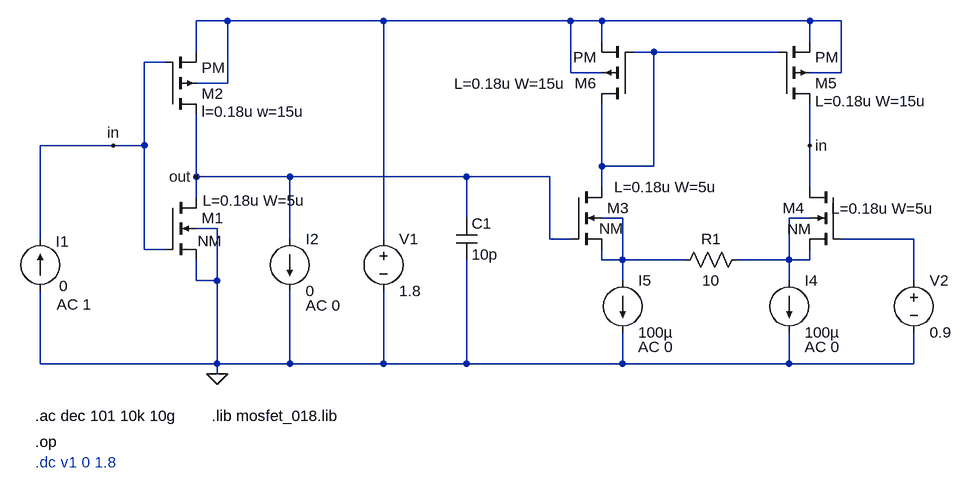
[diagram p0: schematic gyrator.asc]
gyrator.asc, the LTspice schematic file:
Version 4
SHEET 1 2240 2444
WIRE 288 -48 240 -48
WIRE 528 -48 288 -48
WIRE 816 -48 528 -48
WIRE 864 -48 816 -48
WIRE 1184 -48 864 -48
WIRE 1232 -48 1184 -48
WIRE 864 -16 864 -48
WIRE 1184 -16 1184 -48
WIRE 240 0 240 -48
WIRE 944 0 912 0
WIRE 1136 0 944 0
WIRE 192 16 160 16
WIRE 816 32 816 -48
WIRE 864 32 816 32
WIRE 1232 32 1232 -48
WIRE 1232 32 1184 32
WIRE 288 48 288 -48
WIRE 288 48 240 48
WIRE 112 144 0 144
WIRE 160 144 160 16
WIRE 160 144 112 144
WIRE 1184 144 1184 80
WIRE 864 176 864 80
WIRE 944 176 944 0
WIRE 944 176 864 176
WIRE 240 192 240 96
WIRE 384 192 240 192
WIRE 656 192 384 192
WIRE 784 192 656 192
WIRE 864 208 864 176
WIRE 1184 208 1184 144
WIRE 240 224 240 192
WIRE 656 256 656 192
WIRE 896 256 864 256
WIRE 1184 256 1152 256
WIRE 272 272 240 272
WIRE 0 288 0 144
WIRE 384 288 384 192
WIRE 528 288 528 -48
WIRE 784 288 784 192
WIRE 816 288 784 288
WIRE 1344 288 1232 288
WIRE 160 304 160 144
WIRE 192 304 160 304
WIRE 864 320 864 304
WIRE 896 320 896 256
WIRE 896 320 864 320
WIRE 992 320 896 320
WIRE 1152 320 1152 256
WIRE 1152 320 1072 320
WIRE 1184 320 1184 304
WIRE 1184 320 1152 320
WIRE 240 352 240 320
WIRE 272 352 272 272
WIRE 272 352 240 352
WIRE 896 352 896 320
WIRE 1152 352 1152 320
WIRE 1344 352 1344 288
WIRE 0 480 0 368
WIRE 272 480 272 352
WIRE 272 480 0 480
WIRE 384 480 384 368
WIRE 384 480 272 480
WIRE 528 480 528 368
WIRE 528 480 384 480
WIRE 656 480 656 320
WIRE 656 480 528 480
WIRE 896 480 896 432
WIRE 896 480 656 480
WIRE 1152 480 1152 432
WIRE 1152 480 896 480
WIRE 1344 480 1344 432
WIRE 1344 480 1152 480
WIRE 272 496 272 480
FLAG 272 496 0
FLAG 112 144 in
FLAG 240 192 out
FLAG 1184 144 in
SYMBOL nmos4 192 224 R0
WINDOW 3 50 67 Left 2
WINDOW 123 58 5 Left 2
SYMATTR Value NM
SYMATTR Value2 L=0.18u W=5u
SYMATTR InstName M1
SYMBOL voltage 528 272 R0
SYMATTR InstName V1
SYMATTR Value 1.8
SYMBOL pmos4 192 96 M180
WINDOW 123 56 4 Left 2
SYMATTR Value2 l=0.18u w=15u
SYMATTR InstName M2
SYMATTR Value PM
SYMBOL current 0 368 M180
WINDOW 123 25 -21 Left 2
WINDOW 0 24 76 Left 2
WINDOW 3 29 8 Left 2
SYMATTR Value2 AC 1
SYMATTR InstName I1
SYMATTR Value 0
SYMBOL current 384 288 R0
WINDOW 123 24 102 Left 2
SYMATTR Value2 AC 0
SYMATTR InstName I2
SYMATTR Value 0
SYMBOL nmos4 816 208 R0
WINDOW 3 44 64 Left 2
WINDOW 123 67 0 Left 2
SYMATTR Value NM
SYMATTR Value2 L=0.18u W=5u
SYMATTR InstName M3
SYMBOL nmos4 1232 208 M0
WINDOW 3 45 65 Left 2
WINDOW 123 -144 33 Left 2
SYMATTR Value NM
SYMATTR Value2 L=0.18u W=5u
SYMATTR InstName M4
SYMBOL pmos4 1136 80 M180
WINDOW 123 56 4 Left 2
SYMATTR Value2 L=0.18u W=15u
SYMATTR InstName M5
SYMATTR Value PM
SYMBOL pmos4 912 80 R180
WINDOW 123 103 31 Left 2
SYMATTR Value2 L=0.18u W=15u
SYMATTR InstName M6
SYMATTR Value PM
SYMBOL voltage 1344 336 R0
SYMATTR InstName V2
SYMATTR Value 0.9
SYMBOL cap 640 256 R0
SYMATTR InstName C1
SYMATTR Value 10p
SYMBOL current 1152 352 R0
WINDOW 123 24 102 Left 2
SYMATTR Value2 AC 0
SYMATTR InstName I4
SYMATTR Value 100µ
SYMBOL current 896 352 R0
WINDOW 123 24 102 Left 2
SYMATTR Value2 AC 0
SYMATTR InstName I5
SYMATTR Value 100µ
SYMBOL res 1088 304 R90
WINDOW 0 0 56 VBottom 2
WINDOW 3 32 56 VTop 2
SYMATTR InstName R1
SYMATTR Value 10
TEXT -8 632 Left 2 ;.dc v1 0 1.8
TEXT -8 600 Left 2 !.op
TEXT -8 560 Left 2 !.ac dec 101 10k 10g
TEXT 264 560 Left 2 !.lib mosfet_018.lib

The netlist it stands for:
* gyrator.asc
M1 out in 0 0 NM L=0.18u W=5u
V1 N001 0 1.8
M2 out in N001 N001 PM l=0.18u w=15u
I1 0 in 0 AC 1
I2 out 0 0 AC 0
M3 N002 out N003 N003 NM L=0.18u W=5u
M4 in N005 N004 N004 NM L=0.18u W=5u
M5 in N002 N001 N001 PM L=0.18u W=15u
M6 N002 N002 N001 N001 PM L=0.18u W=15u
V2 N005 0 0.9
C1 out 0 10p
I4 N004 0 100µ AC 0
I5 N003 0 100µ AC 0
R1 N004 N003 10
.model NMOS NMOS
.model PMOS PMOS
.lib standard.mos
* .dc v1 0 1.8
.op
.ac dec 101 10k 10g
.lib mosfet_018.lib
.backanno
.end